# Altium schematic sheet CurrentConditioning.SchDoc
size A4; Organization: UltraZohm; DocumentNumber: 3; SheetNumber: 3; SheetTotal: 11; SPICEModelCacheMURSBSRZ: <root> / <DocumentId>MURSBSRZ</DocumentId> / </root>; Website: www.ultrazohm.com
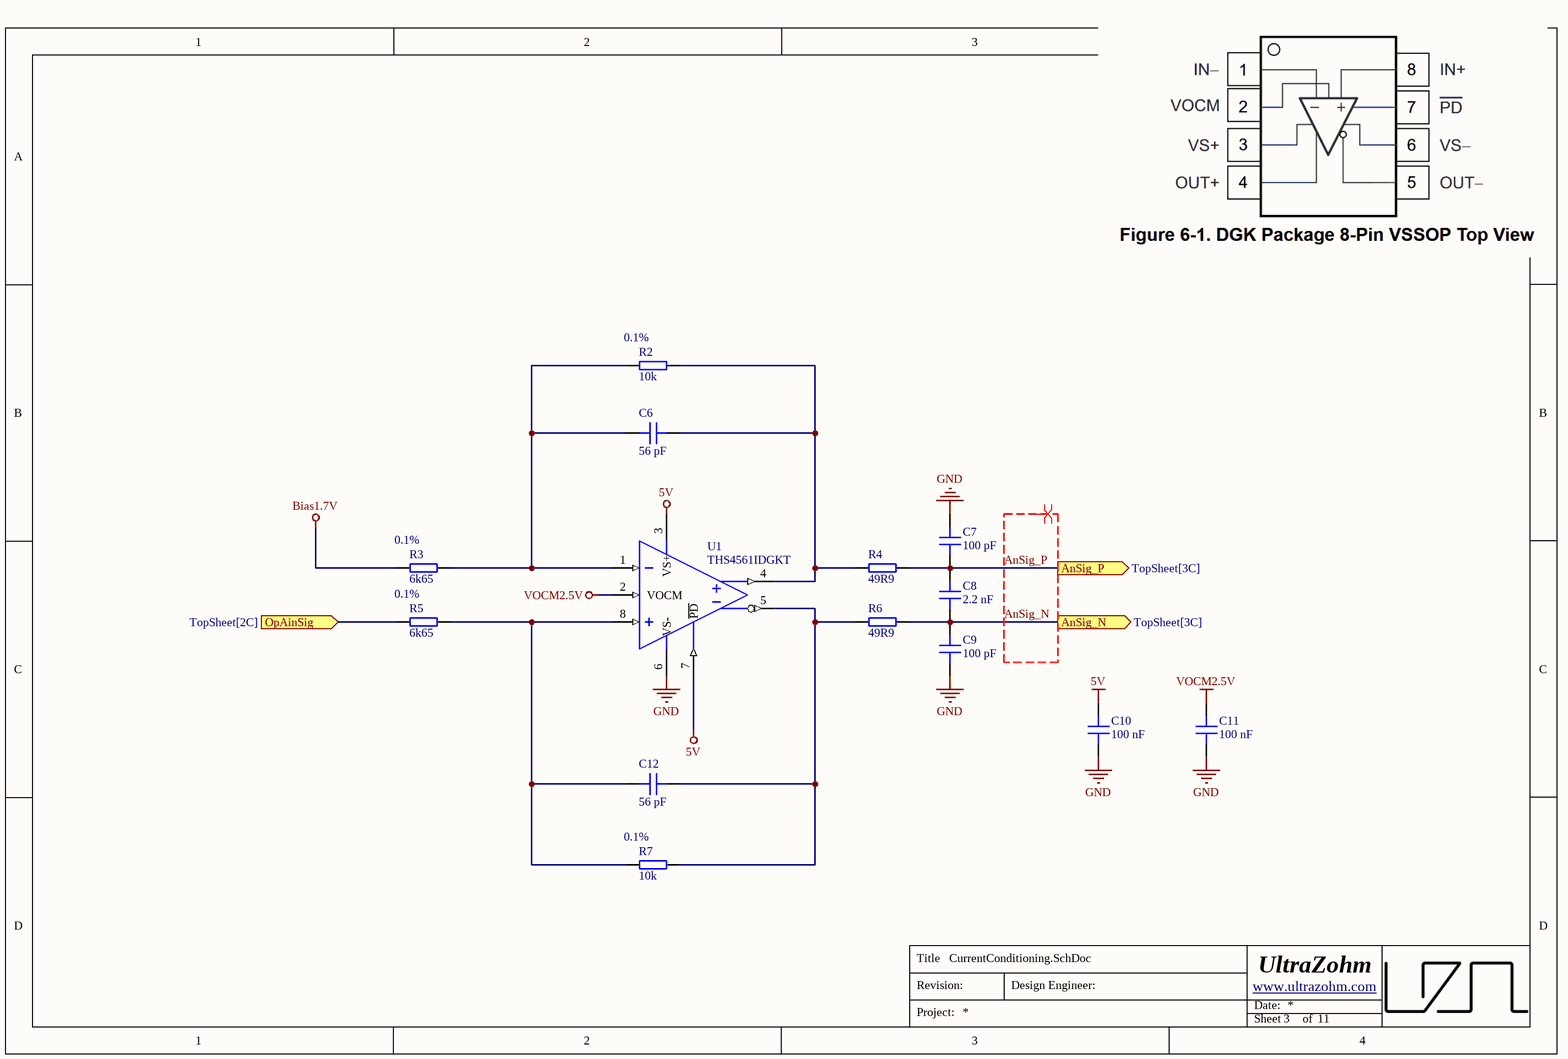
[diagram p0: CurrentConditioning.SchDoc]

## Parts
C6  56 pF  [C_0603]
C7  100 pF  [C_0603_TE]
C8  2.2 nF  [C_0603]
C9  100 pF  [C_0603_TE]
C10  100 nF  [C_0603]
C11  100 nF  [C_0603]
C12  56 pF  [C_0603]
R2  10k  Tolerance: 0.1%  [RES 0603_1608]
R3  6k65  Tolerance: 0.1%  [RES 0603_1608]
R4  49R9  [RES 0603_1608]
R5  6k65  Tolerance: 0.1%  [RES 0603_1608]
R6  49R9  [RES 0603_1608]
R7  10k  Tolerance: 0.1%  [RES 0603_1608]
U1  THS4561IDGKT  [SOP65P490X110-8N]

## Ports
AnSig_N (out, see TopSheet[3C]), AnSig_P (out, see TopSheet[3C]), OpAinSig (in, see TopSheet[2C])

## Nets
5V: C10.1 U1.3(VS+) U1.7(~{PD})
Bias1.7V: R3.1
GND: C7.1 C9.2 C10.2 C11.2 U1.6(VS-)
VOCM2.5V: C11.1 U1.2(VOCM)
AnSig_N: C8.2 C9.1 R6.2 ; port AnSig_N
AnSig_P: C7.2 C8.1 R4.2 ; port AnSig_P
OpAinSig: R5.1 ; port OpAinSig
NetC6_1: C6.1 R2.1 R3.2 U1.1(VIN-)
NetC6_2: C6.2 R2.2 R4.1 U1.4(VOUT+)
NetC12_1: C12.1 R5.2 R7.1 U1.8(VIN+)
NetC12_2: C12.2 R6.1 R7.2 U1.5(VOUT-)

## Layout directives
differential pair: AnSig_N, AnSig_P

## Notes on the sheet
- Title
- Revision:
- Design Engineer:
- Date:
- Project:
- Sheet
- of

## Library data of the parts
C6 C12 = CL10C560JB8NNNC: Capacitor 0603, 50 VDC, 56 pF, C0G; Manufacturer: Samsung Electro-Mechanics; Tolerance: 5 %; Voltage Rating: 50 VDC; Created from: DHufnagel; Manufacturer Part Number: CL10C560JB8NNNC; PartID: 92; Created On: 20.12.2020 13:54:13; ComponentLink1Description: Datasheet; ComponentLink1URL: https://www.mouser.de/datasheet/2/585/MLCC-1837944.pdf; Component Type: Capacitor 0603; Device Package: 0603; Last Updated: 20.12.2020 16:24:16; Mounting Type: SMD; Operating Temperature: -55 - 125°C; Series: CL; Supplier 1: Mouser; Supplier Part Number 1: 187-CL10C560JB8NNNC; Supplier 2: LCSC; Supplier Part Number 2: C39148; Type: Capacitor; Value: 56 pF; Live Cycle Status: 1; LCSC Part Number: C39148; Stock number: not stored
C7 C9 = CL10C101JB8NNNC: 50V 100pF C0G ±5% 0603 Multilayer Ceramic Capacitors MLCC - SMD/SMT ROHS; Manufacturer: Samsung Electro-Mechanics; Voltage Rating: 50 VDC; Created from: AGeiger; Manufacturer Part Number: CL10C101JB8NNNC; PartID: 106; Created On: 03/09/2022 10:55:28; ComponentLink1Description: Datasheet; ComponentLink1URL: https://datasheet.lcsc.com/lcsc/1811151136_Samsung-Electro-Mechanics-CL10C101JB8NNNC_C14858.pdf; Component Type: Capacitor 0603; Device Package: 0603; Last Updated: 08/08/2024 13:37:35; Mounting Type: SMD; Operating Temperature: -55 - 125°C; Series: C0G; Supplier 1: LCSC; Supplier Part Number 1: C14858; Supplier 2: Mouser; Supplier Part Number 2: 187-CL10C101JB8NNNC; Type: Capacitor; Tolerance: 5 %; Value: 100 pF; Live Cycle Status: 1; LCSC Part Number: C14858
C8 = 06035C222JAT2A: Capacitor 0603, 50 VDC, 2.2 nF, X7R; Manufacturer: AVX; Tolerance: 5 %; Voltage Rating: 50 VDC; Created from: MGremer; Manufacturer Part Number: 06035C222JAT2A; PartID: 77; Created On: 20/12/2020 13:54:13; ComponentLink1Description: Datasheet; ComponentLink1URL: https://www.mouser.de/datasheet/2/40/X7RDielectric-777024.pdf; Component Type: Capacitor 0603; Device Package: 0603; Last Updated: 15/02/2023 17:14:22; Mounting Type: SMD; Operating Temperature: -55 - 125°C; Series: MLCC X7R; Supplier 1: LCSC; Supplier Part Number 1: C86023; Supplier 2: LCSC; Supplier Part Number 2: C86023; Type: Capacitor; Value: 2.2 nF; Live Cycle Status: 1; Stock number: not stored; LCSC Part Number: C93190
C10 C11 = C0603C104K5RAC3121: Capacitor 0603, 50 VDC, 100nF, X7R; Manufacturer: KEMET; Tolerance: 10 %; Voltage Rating: 50 VDC; Created from: DHufnagel; Manufacturer Part Number: C0603C104K5RAC3121; PartID: 99; Created On: 11/08/2022 14:33:29; ComponentLink1Description: Datasheet; ComponentLink1URL: https://www.mouser.de/datasheet/2/212/KEM_C1023_X7R_AUTO_SMD-1093309.pdf; Component Type: Capacitor 0603; Device Package: 0603; Last Updated: 19/08/2022 08:26:58; Mounting Type: SMD; Operating Temperature: -55 - 125°C; Series: X7R; Supplier 1: Mouser; Supplier Part Number 1: 80-C603C104K5RAC3121; Supplier 2: LCSC; Supplier Part Number 2: C14663; Type: Capacitor; Value: 100 nF; Live Cycle Status: 1; LCSC Part Number: C14663; Stock number: not stored
R2 R7 = ERA-3ARB103V: SMD resistor 0.1%, 10ppm; Manufacturer: Panasonic; Created from: DHufnagel; Manufacturer Part Number: ERA-3ARB103V; PartID: 217; Created On: 14/12/2020 16:17:14; ComponentLink1Description: Datasheet; ComponentLink1URL: https://www.mouser.de/datasheet/2/315/AOA0000C307-1149632.pdf; Component Type: SMD resistor; Device Package: 0603; Last Updated: 25/07/2022 10:07:28; Mounting Type: SMD; Supplier 1: Mouser; Supplier Part Number 1: 667-ERA-3ARB103V; Type: Resistor; Value: 10k; Live Cycle Status: 1; Stock number: not stored; LCSC Part Number: C860067
R3 R5 = RT0603BRD076K65L: 100mW Thin Film Resistor ±25ppm/℃ ±0.1% 6.65kΩ 0603 Chip Resistor - Surface Mount ROHS; Manufacturer: YAGEO; Created from: SPark; Manufacturer Part Number: RT0603BRD076K65L; PartID: 361; Created On: 30/01/2025 15:18:29; ComponentLink1Description: Datasheet; ComponentLink1URL: https://wmsc.lcsc.com/wmsc/upload/file/pdf/v2/lcsc/2210190000_YAGEO-RT0603BRD076K65L_C861536.pdf; Component Type: SMD resistor; Device Package: 0603; Last Updated: 30/01/2025 15:27:22; Mounting Type: SMD; Supplier 1: LCSC/JLCPCB; Supplier Part Number 1: C861536; Type: Resistor; Value: 6k65; Live Cycle Status: 1; LCSC Part Number: C861536
R4 R6 = RK73H1JTTD49R9F: SMD resistor 1%; Manufacturer: KOA Speer; Created from: DHufnagel; Manufacturer Part Number: RK73H1JTTD49R9F; PartID: 214; Created On: 14.12.2020 16:17:14; ComponentLink1Description: Datasheet; ComponentLink1URL: https://www.mouser.de/datasheet/2/219/RK73H-1825326.pdf; Component Type: SMD resistor; Device Package: 0603; Last Updated: 27.05.2022 13:46:35; Mounting Type: SMD; Supplier 1: Mouser; Supplier Part Number 1: 660-RK73H1JTTD49R9F; Supplier 2: LCSC; Supplier Part Number 2: C160046; Type: Resistor; Tolerance: 1%; Value: 49R9; Live Cycle Status: 1; Stock number: not stored; LCSC Part Number: C160046
U1 = THS4561IDGKT: Fully Differential Amplifier, Low-Power, High Supply Range, 60-MHz; Manufacturer: Texas Instruments; Channels: 1; GBP: 68 MHz; CMRR: 110 dB; Value: Rail-to-Rail; Created from: DHufnagel; Manufacturer Part Number: THS4561IDGKT; PartID: 13; Created On: 08/07/2022 14:29:07; ComponentLink1Description: Datasheet; ComponentLink1URL: https://www.ti.com/general/docs/suppproductinfo.tsp?distId=26&gotoUrl=https://www.ti.com/lit/gpn/ths4561; Component Type: Differential Amplifier; Device Package: VSSOP-8; Last Updated: 30/09/2024 15:54:43; Mounting Type: SMD; Operating Temperature: -40 to +125 °C; Series: THS4561; Supplier 1: Mouser; Supplier Part Number 1: 595-THS4561IDGKT; Supplier 2: Digi-Key; Supplier Part Number 2: 296-THS4561IDGKTCT-ND; Type: Differential Amplifiers; Live Cycle Status: 1; Stock number: not stored; LCSC Part Number: C2860980